# Altium schematic sheet pH Sensor Unit.SchDoc
size A4; SheetNumber: 5; SheetTotal: 8
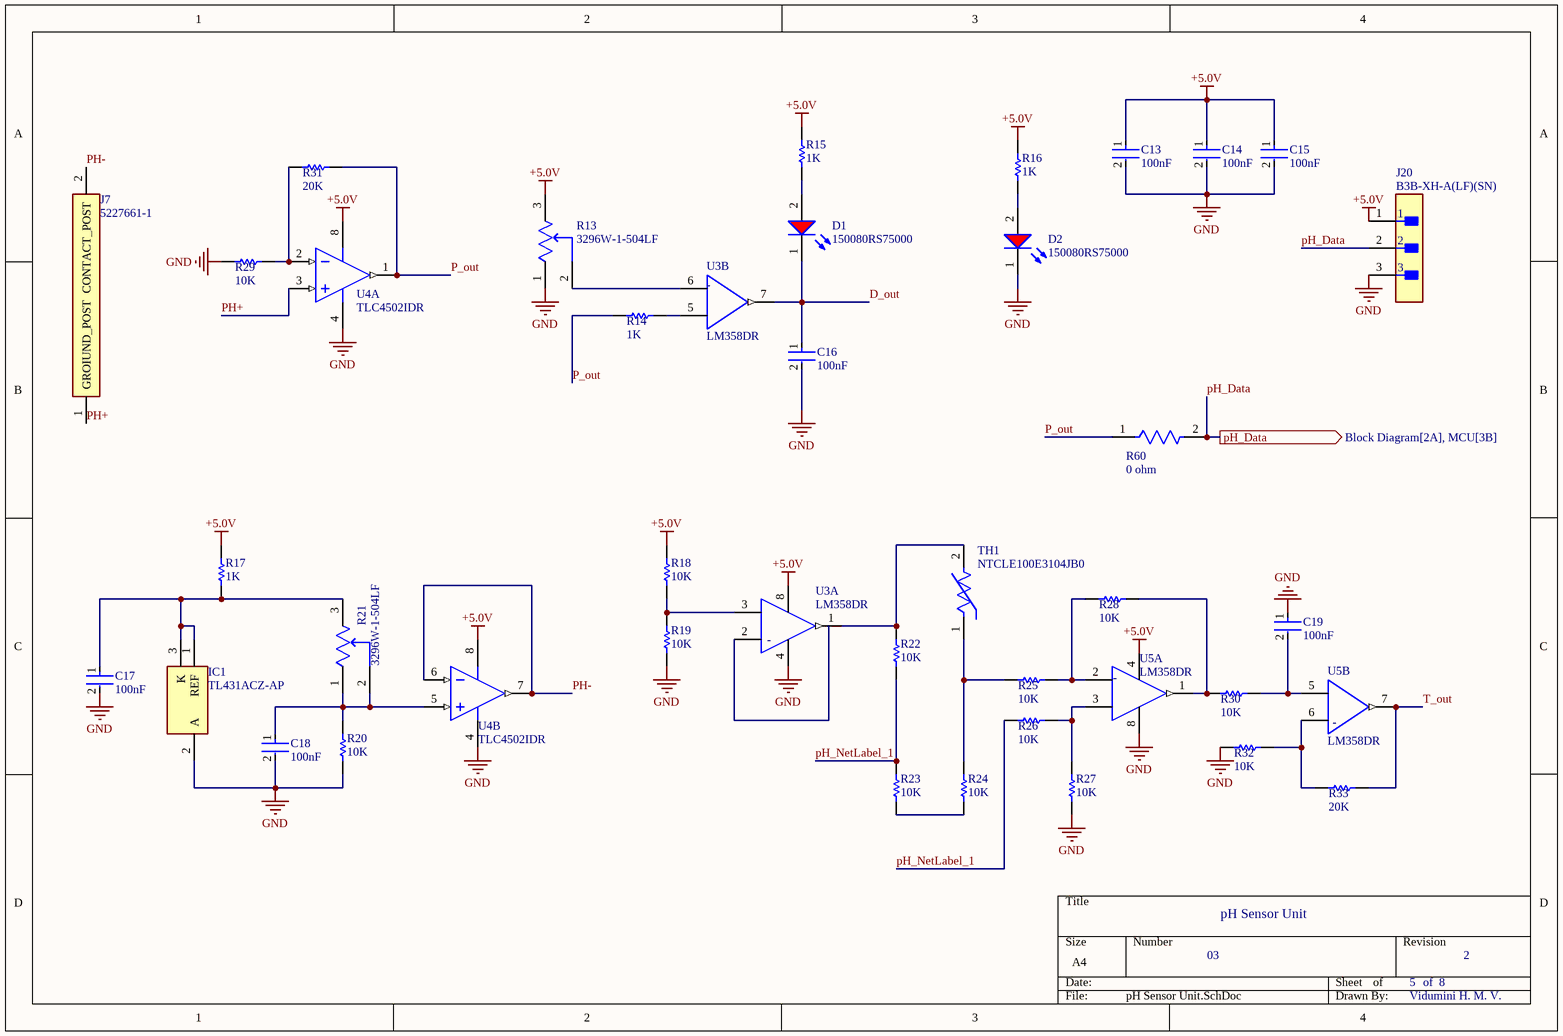
[diagram p0: pH Sensor Unit.SchDoc]

## Parts
C13  100nF  [FP-1206-L_3_2_0_2-W_1_6_0-IPC_C]
C14  100nF  [FP-1206-L_3_2_0_2-W_1_6_0-IPC_C]
C15  100nF  [FP-1206-L_3_2_0_2-W_1_6_0-IPC_C]
C16  100nF  [FP-1206-L_3_2_0_2-W_1_6_0-IPC_C]
C17  100nF  [FP-1206-L_3_2_0_2-W_1_6_0-IPC_C]
C18  100nF  [FP-1206-L_3_2_0_2-W_1_6_0-IPC_C]
C19  100nF  [FP-1206-L_3_2_0_2-W_1_6_0-IPC_C]
D1  150080RS75000  [WL-SMCW_0805_150080xx75000]
D2  150080RS75000  [WL-SMCW_0805_150080xx75000]
IC1  TL431ACZ-AP  [TO-92_BULK]
J7  5227661-1  [5227161-1]
J20  B3B-XH-A(LF)(SN)  [FP-B3B-XH-A_LF_SN-MFG]
R13  3296W-1-504LF  [FP-3296W-MFG]
R14  1K  [RESC3116X65X40ML10T20]
R15  1K  [RESC3116X65X40ML10T20]
R16  1K  [RESC3116X65X40ML10T20]
R17  1K  [RESC3116X65X40ML10T20]
R18  10K  [RESC3116X65X40ML10T20]
R19  10K  [RESC3116X65X40ML10T20]
R20  10K  [RESC3116X65X40ML10T20]
R21  3296W-1-504LF  [FP-3296W-MFG]
R22  10K  [RESC3116X65X40ML10T20]
R23  10K  [RESC3116X65X40ML10T20]
R24  10K  [RESC3116X65X40ML10T20]
R25  10K  [RESC3116X65X40ML10T20]
R26  10K  [RESC3116X65X40ML10T20]
R27  10K  [RESC3116X65X40ML10T20]
R28  10K  [RESC3116X65X40ML10T20]
R29  10K  [RESC3116X65X40ML10T20]
R30  10K  [RESC3116X65X40ML10T20]
R31  20K  [RESC3116X65X40ML10T20]
R32  10K  [RESC3116X65X40ML10T20]
R33  20K  [RESC3116X65X40ML10T20]
R60  0 ohm  [FP-AF0603-IPC_B]
TH1  NTCLE100E3104JB0  [FP-NTCLE100E3104JB0-MFG]
U3  LM358DR  [FP-D0008A-MFG]  (parts A,B of 2)
U4  TLC4502IDR  [D0008A_L]  (parts A,B of 2)
U5  LM358DR  [FP-D0008A-MFG]  (parts A,B of 2)

## Ports
pH_Data (out, see Block Diagram[2A], MCU[3B])

## Nets
+5.0V: C13.1 C14.1 C15.1 J20.1 R13.3(CW) R15.2 R16.2 R17.2 R18.2 U3.8(V+) U4.8(VDD+) U5.4(V-)
GND: C13.2 C14.2 C15.2 C16.2 C17.2 C18.2 C19.1 D2.1(K) IC1.2(A) J20.3 R13.1(CCW) R19.1 R20.1 R27.1 R29.1 R32.1 U3.4(V-) U4.4(VDD-/GND) U5.8(V+)
D_out: C16.1 D1.1(K) U3.7(2OUT)
P_out: R14.2 R31.2 R60.1 U4.1(OUT1)
PH+: J7.1(GROIUND_POST) U4.3(IN1+)
PH-: J7.2(CONTACT_POST) U4.6(IN2-) U4.7(OUT2)
pH_Data: J20.2 R60.2 ; port pH_Data
pH_NetLabel_1: R22.1 R23.2 R26.1
T_out: R33.2 U5.7(2OUT)
NetC17_1: C17.1 IC1.1(REF) IC1.3(K) R17.1 R21.3(CW)
NetC18_1: C18.1 R20.2 R21.1(CCW) R21.2(WIPER) U4.5(IN2+)
NetC19_2: C19.2 R30.2 U5.5(IN2+)
NetD1_2: D1.2(A) R15.1
NetD2_2: D2.2(A) R16.1
NetR13_2: R13.2(WIPER) U3.6(IN2-)
NetR14_1: R14.1 U3.5(IN2+)
NetR18_1: R18.1 R19.2 U3.3(IN1+)
NetR22_2: R22.2 TH1.2 U3.1(1OUT)
NetR23_1: R23.1 R24.1
NetR24_2: R24.2 R25.1 TH1.1
NetR25_2: R25.2 R28.1 U5.2(IN1-)
NetR26_2: R26.2 R27.2 U5.3(IN1+)
NetR28_2: R28.2 R30.1 U5.1(1OUT)
NetR29_2: R29.2 R31.1 U4.2(IN1-)
NetR32_2: R32.2 R33.1 U5.6(IN2-)

Not connected (* = marked no-connect by the designer): U3 2(IN1-)

## Notes on the sheet
- pH Sensor Unit
- 03
- 5
- of  8
- 2
- Vidumini H. M. V.
- (in symbol CMP-1685-00009-2, part A) -
- (in symbol CMP-1685-00009-2, part B) -

## Library data of the parts
C13-C19 = CMP-04427-013576-1: General Purpose Ceramic Capacitor, 1206, 100nF, 5%, X7R, 15%, 100V; Max Operating Temperature: 125°C; Depth: 1.6mm; Package Quantity: 1; Thickness: 0.05inch; Number of Pins: 2; Height: 1.27mm; Voltage Rating (DC): 100V; Radiation Hardening: No; Termination: SMD/SMT; Construction: Flat; REACH SVHC: No SVHC; Case/Package: 1206; Case Code (Imperial): 1206; Tolerance: 5%; Width: 0.063inch; Voltage: 100V; Packaging: Tape and Reel; Voltage Rating: 100V; Case Code (Metric): 3216; Capacitance: 100nF; Min Operating Temperature: -55°C; Length: 3.2mm; Dielectric: X7R; Mount: Surface Mount; Dielectric Material: Ceramic; Contact Plating: Tin; RoHS Compliant: Yes; Lead Free: Lead Free; Series: -
D1 D2 = CMP-1426-00011-2: NexarPartId: 29717781; Peak Wavelength: 630nm; Wavelength: 625nm; Viewing Angle: 140°; Test Current: 20mA; Forward Voltage: 2V; Forward Current: 100mA; Lens Style: Clear, Rectangular; Color: Red; Luminous Intensity: 150mcd; Max Reverse Voltage (DC): 5V; Length: 2mm; Case Code (Imperial): 0805; RoHS: Compliant; Max Operating Temperature: 85°C; Height: 700µm; Packaging: Tape and Reel; Case/Package: 0805; REACH SVHC: Unknown; Dominant Wavelength: 625nm; Min Operating Temperature: -40°C; Case Code (Metric): 2012; Mount: Surface Mount; Width: 1.25mm
IC1 = TL431ACZ-AP: Integrated Circuit; Manufacturer_Name: STMicroelectronics; Datasheet Link: http://www.st.com/web/en/resource/technical/document/datasheet/CD00000986.pdf; Manufacturer_Part_Number: TL431ACZ-AP; Mouser Part Number: 511-TL431ACZ-AP; Mouser Price/Stock: https://www.mouser.co.uk/ProductDetail/STMicroelectronics/TL431ACZ-AP?qs=s3pp7IaNhi3mo0aKrMbVlw%3D%3D; Arrow Part Number: TL431ACZ-AP; Arrow Price/Stock: https://www.arrow.com/en/products/tl431acz-ap/stmicroelectronics?region=nac
J7 = 5227661-1: Connector; Manufacturer_Name: TE Connectivity; Datasheet Link: https://www.te.com/commerce/DocumentDelivery/DDEController?Action=srchrtrv&DocNm=1307191_BNC_Connectors&DocType=Catalog%20Section&DocLang=English&PartCntxt=5227661-1&DocFormat=pdf; Manufacturer_Part_Number: 5227661-1; Mouser Part Number: 571-5227661-1; Mouser Price/Stock: https://www.mouser.co.uk/ProductDetail/TE-Connectivity/5227661-1?qs=GSeC4G%252BEqEUTcTZ6HpL7ew%3D%3D; Arrow Part Number: 5227661-1; Arrow Price/Stock: https://www.arrow.com/en/products/5227661-1/te-connectivity?region=nac
J20 = CMP-17439-000014-3: CONN HEADER VERT 3POS 2.5MM; Max Voltage Rating (DC): 250V; Number of Positions: 3; Current Rating: 3A; Gender: Male; Wire/Cable Gauge: 22AWG; Contact Resistance: 20mR; Insulation Resistance: 1GR; Insulation Material: Nylon; Contact Plating: Tin; Depth: 5.75mm; Contact Type: Male Pin; Max Operating Temperature: 85°C; Insulation Color: Natural; Voltage Rating (AC): 250V; Color: Natural; Connector Type: Header; Orientation: Straight; Fastening Type: Detent; Housing Color: White; Min Operating Temperature: -25°C; Termination: Solder; Voltage Rating: 250V; Series: XH; Pitch: 2.5mm; Contact Shape: Square; Number of Rows: 1; Lead Free: Lead Free; Packaging: Bulk; Mount: Through Hole; Flammability Rating: UL94 V-0; Max Voltage Rating (AC): 250V; REACH SVHC: No SVHC; Housing Material: Polyamide; Contact Material: Brass; Lead Pitch: 2.5mm; Contact Finish - Mating: TIN; Length: 9.9mm; Max Current Rating: 3A; Number of Contacts: 3
R13 R21 = CMP-2000-05583-2: TRIMMER 500K OHM 0.5W PC PIN TOP; Manufacturer: Bourns; Resistance: 500kΩ; Temperature Coefficient: 100ppm/°C; Value: 500kΩ; Tolerance: 10%; Voltage Rating: 300V; Standoff Height: 0.38mm; ComponentLink2Description: Datasheet; Package: 3296W; Series: Trimpot 3296-Sealed; Lead Free: Yes; Octopart: https://octopart.com/3296w-1-504lf-bourns-143884; Device Class L2: Resistors; Automotive: No; RoHS: TRUE; Temperature Range High: +125°C; Manufacturer Part Number: 3296W-1-504LF; Height: 12.05mm; Power Rating: 0.5W; Temperature Range Low: -55°C; ComponentLink2URL: https://www.bourns.com/docs/Product-Datasheets/3296.pdf; Device Class L1: Passive Components; Device Class L3: Variable Resistors and Potentiometers; Category: Res; Temperature: -55°C to +125°C; Digikey Description: TRIMMER 500K OHM 0.5W PC PIN TOP; Mouser Description: Trimmer; Cermet; Rest 500 Kilohms; PCB; 25 Turns; Pwr-Rtg 0.5W
R14-R20 R22-R33 = CMP-1014-00623-2: Chip Resistor, 10 KOhm, +/- 1%, 0.25 W, -55 to 155 degC, 1206 (3216 Metric), RoHS, Tape and Reel; Manufacturer: Yageo; Voltage Rating: 200V; Resistance: 10KOhm; Temperature Coefficient: 100ppm/degreesC; Power Rating: 250mW; Packaging: TapeandReel; Termination: SMD/SMT; REACH SVHC: Unknown; Tolerance: 1%; Height: 0.55mm; Composition: ThickFilm; Max Operating Temperature: 155degC; Datasheet Version: Rev. 5, 10/2016; Lead Free: LeadFree; Case Code (Metric): 3216; Depth: 1.6mm; Package Quantity: 5000; RoHSCompliant: true; Military Standard: Not; Case/Package: 1206; Case Code (Imperial): 1206; Min Operating Temperature: -55degC; Datasheet URL: http://www.yageo.com/NewPortal/yageodocoutput?fileName=/pdf/R-Chip/PYu-RC_Group_51_RoHS_L_5.pdf; Length: 3.1mm; Manufacturer URL: http://www.yageo.com/; Package Reference: 1206.0; Width: 1.6mm; Package Description: 2-Pin Surface Mount Device, Body 3.1 x 1.6 mm
R60 = CMP-03412-043191-1: Anti-Sulfurated Chip Resistors Automotive Grade 1.5kΩ 1% 100ppm/°C 0603; Resistance: 1.5kR; Max Power Dissipation: 100mW; Length: 0.063inch; Packaging: Tape and Reel; Tolerance: 1%; RoHS Compliant: Yes; Series: AF; Temperature Coefficient: 100ppm/°C; Case/Package: 0603; Height: 0.022inch; Min Operating Temperature: -55°C; Resistor Type: Thick Film; Features: Moisture Resistant; Width: 0.031inch; Number of Terminations: 2; Max Operating Temperature: 155°C
TH1 = CMP-02404-000021-1: NTC THERMISTOR 100K OHM 5% BEAD; Lead Diameter: 0.6mm; Accuracy: 1.5%; Max Power Dissipation: 500mW; Lead Length: 17mm; Resistance: 100kR; Package Quantity: 500; Resistance Tolerance: 5%; Height: 9mm; Case/Package: Radial; Depth: 3mm; Lead Free: Lead Free; Tolerance: 5%; Number of Pins: 2; RoHS Compliant: Yes; Lead Pitch: 2.54mm; Min Operating Temperature: -40°C; Termination: Radial; Series: 2322; Length: 3.3mm; Radiation Hardening: No; Mount: Through Hole; Max Operating Temperature: 125°C; Packaging: Bulk
U3 U5 = CMP-1685-00009-2: IC OPAMP GP 2 CIRCUIT 8SOIC; Output Current: 30mA; Min Dual Supply Voltage: 1.5V; Input Offset Voltage (Vos): 7mV; Power Supply Rejection Ratio (PSRR): 65dB; Unity Gain Bandwidth Product: 700kHz; Number of Channels: 2; Min Supply Voltage: 3V; Max Dual Supply Voltage: 16V; Dual Supply Voltage: 9V; Max Supply Voltage: 32V; Nominal Supply Current: 1.2mA; Slew Rate: 0.3V/µs; Input Bias Current: 250nA; Voltage Gain: 100dB; Operating Supply Current: 1mA; REACH SVHC: No SVHC; Package Quantity: 2500; Width: 3.91mm; Max Operating Temperature: 70°C; Min Operating Temperature: 0°C; Mount: Surface Mount; Length: 4.9mm; Radiation Hardening: No; Case/Package: SOIC; Lead Free: Lead Free; Number of Elements: 2; Packaging: Tape and Reel; Output Current per Channel: 30mA; Number of Circuits: 2; Bandwidth: 700kHz; Operating Supply Voltage: 16V; Gain Bandwidth Product: 700kHz; Number of Pins: 8; Number of Amplifiers: 2; Height: 1.58mm; Common Mode Rejection Ratio: 65dB; Contact Plating: Gold
U4 = CMP-0272-00725-3: Advanced LinEPIC Self-Calibrating Precision Dual Operational Amplifier, 4 to 6 V, -40 to 125 degC, 8-pin SOIC (D8), Green (RoHS & no Sb/Br); Manufacturer: Texas Instruments; Vn at 1kHz(Typ)(nV/rtHz): 12; IIB(Max)(pA): 60; Total Supply Voltage(Min)(+5V is 5, +/-5V is 10): 4; Number of Channels: 2; Total Supply Voltage(Max)(+5V is 5, +/-5V is 10): 6; Iq per channel(Max)(mA): 3.5; Slew Rate(Typ)(V/us): 2.5; Offset Drift(Typ)(uV/C): 1; Vio (25C)(Max)(mV): 0.1; Sub Family: Low Offset Voltage Amplifier (<=500uV), Precision Amplifier; CMRR(Min)(dB): 90; Eco-Plan: Green (RoHS & no Sb/Br); ComponentLink1Description: Manufacturer URL; PartNumber: TLC4502IDR; DatasheetVersion: SLOS221B; ComponentLink2URL: http://www.ti.com/general/docs/lit/getliterature.tsp?genericPartNumber=TLC4502&fileType=pdf; ComponentLink2Description: Datasheet; Mounting Technology: Surface Mount; ComponentLink3URL: http://www.ti.com/litv/pdf/msoi002j; PackageVersion: 4040047-3/M, 06/2011; ComponentLink3Description: Package Specification; ComponentLink1URL: http://www.ti.com/; PackageReference: D0008A; PackageDescription: 8-Pin Plastic Small Outline, Body 4.9 x 3.9 mm, Pitch 1.27 mm; Code_JEDEC: MS-012